# EAGLE design Main_board (EAGLE 8.0.1)
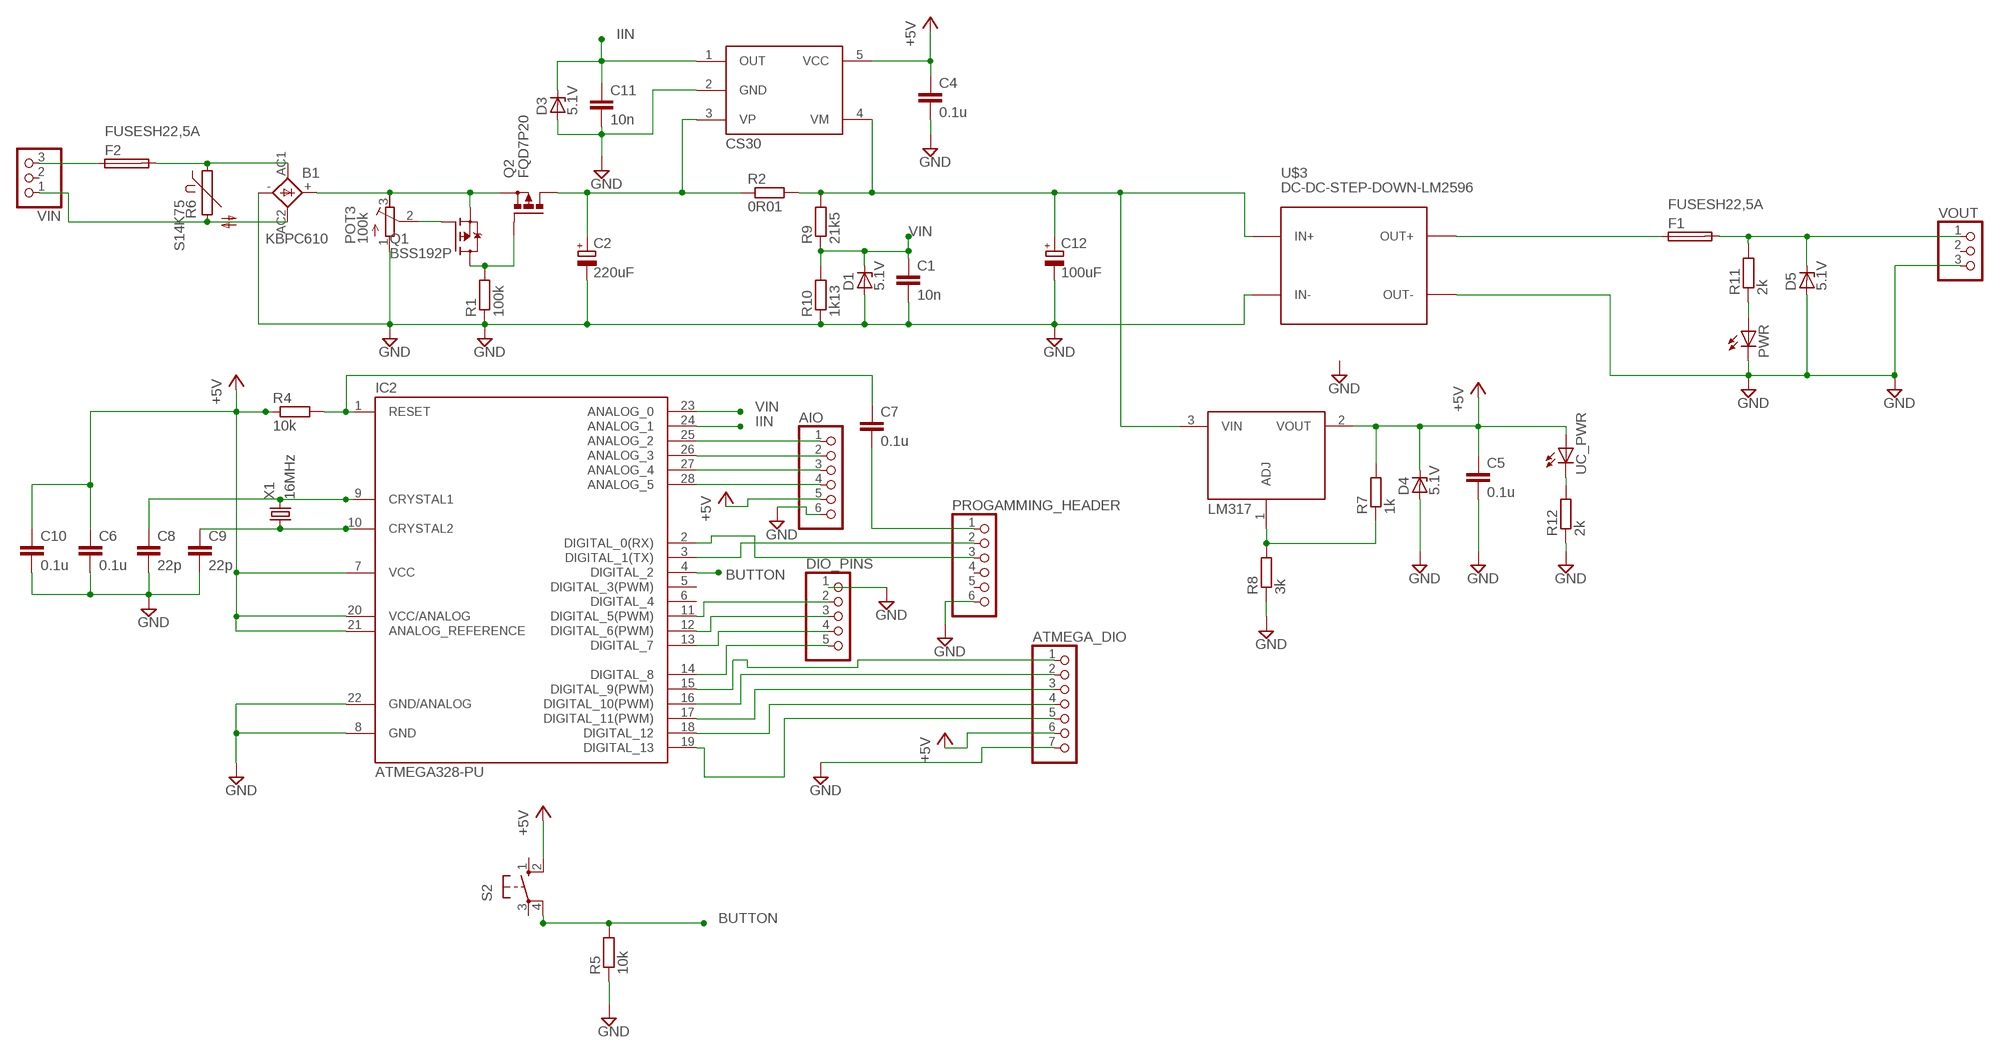
[diagram p0: schematic, sheet 1]

## Parts
AIO  PINHD-1X6  [1X06]
ATMEGA_DIO  PINHD-1X7  [1X07]
B1  KBPC610  GBPC6  [GBPC6]
C1  10n  C-EUC1206K  [C1206K]
C2  220uF  CPOL-EUE3.5-10  [E3,5-10]
C4  0.1u  C-EUC1206K  [C1206K]
C5  0.1u  C-EUC1206K  [C1206K]
C6  0.1u  C-EUC1206K  [C1206K]
C7  0.1u  C-EUC1206K  [C1206K]
C8  22p  C-EUC0805K  [C0805K]
C9  22p  C-EUC0805K  [C0805K]
C10  0.1u  C-EUC1206K  [C1206K]
C11  10n  C-EUC1206K  [C1206K]
C12  100uF  CPOL-EUE3.5-8  [E3,5-8]
D1  5.1V  ZPD  [DO35Z10]
D3  5.1V  ZPD  [DO35Z10]
D4  5.1V  ZPD  [DO35Z10]
D5  5.1V  ZPD  [DO35Z10]
DIO_PINS  PINHD-1X5  [1X05]
F1  FUSESH22,5A  [SH22,5A]
F2  FUSESH22,5A  [SH22,5A]
IC2  ATMEGA328-PU  ATMEGA168-PU  [DIL28-3]
POT3  100k  R-TRIMM3296W  [RTRIM3296W]
PROGAMMING_HEADER  PINHD-1X6  [1X06]
PWR  LEDSMT1206  [1206]
Q1  BSS192P  [BSS192P]
Q2  FQD7P20  [TO252]
R1  100k  R-EU_0207/10  [0207/10]
R2  0R01  R-EU_M1206  [M1206]
R4  10k  R-EU_R1206  [R1206]
R5  10k  R-EU_R1206  [R1206]
R6  S14K75  S14K17  [S14K17]
R7  1k  R-EU_R1206  [R1206]
R8  3k  R-EU_R1206  [R1206]
R9  21k5  R-EU_R0805  [R0805]
R10  1k13  R-EU_R0805  [R0805]
R11  2k  R-EU_R1206  [R1206]
R12  2k  R-EU_R1206  [R1206]
S2  10-XX  [B3F-10XX]
U$1  LM317  [TO220BH]
U$2  CS30  [SOT23-5L]
U$3  DC-DC-STEP-DOWN-LM2596  [DC-DC-STEP-DOWN-LM2596]
UC_PWR  LEDSMT1206  [1206]
VIN  PINHD-1X3  [1X03]
VOUT  PINHD-1X3  [1X03]
X1  16MHz  CRYSTALHC49S  [HC49/S]

## Nets
+5V: AIO.5 ATMEGA_DIO.6 C4.1 C5.1 C6.1 C10.1 D4.C IC2.7(VCC) IC2.20(VCC/ANALOG) IC2.21(ANALOG_REFERENCE) R4.1 R7.2 S2.2(S1) U$1.2(VOUT) U$2.5(VCC) UC_PWR.A
ANALOG_2: AIO.1 IC2.25(ANALOG_2)
ANALOG_3: AIO.2 IC2.26(ANALOG_3)
ANALOG_4: AIO.3 IC2.27(ANALOG_4)
ANALOG_5: AIO.4 IC2.28(ANALOG_5)
BUTTON: IC2.4(DIGITAL_2) R5.2 S2.4(P1)
CRYSTAL1: C8.1 IC2.9(CRYSTAL1) X1.2
CRYSTAL2: C9.1 IC2.10(CRYSTAL2) X1.1
D5: DIO_PINS.2 IC2.11(DIGITAL_5(PWM))
D6: DIO_PINS.3 IC2.12(DIGITAL_6(PWM))
D7: DIO_PINS.4 IC2.13(DIGITAL_7)
D8: DIO_PINS.5 IC2.14(DIGITAL_8)
D9: ATMEGA_DIO.1 IC2.15(DIGITAL_9(PWM))
D10: ATMEGA_DIO.2 IC2.16(DIGITAL_10(PWM))
D11: ATMEGA_DIO.3 IC2.17(DIGITAL_11(PWM))
D12: ATMEGA_DIO.4 IC2.18(DIGITAL_12)
D13: ATMEGA_DIO.5 IC2.19(DIGITAL_13)
GND: AIO.6 ATMEGA_DIO.7 B1.- C1.2 C2.- C4.2 C5.2 C6.2 C8.2 C9.2 C10.2 C11.2 C12.- D1.A D3.A D4.A D5.A DIO_PINS.1 IC2.8(GND) IC2.22(GND/ANALOG) POT3.1(A) PROGAMMING_HEADER.6 PWR.C R1.1 R5.1 R8.1 R10.1 R12.1 U$2.2(GND) U$3.IN- U$3.OUT- VOUT.3
IIN: C11.1 D3.C IC2.24(ANALOG_1) U$2.1(OUT)
N$1: F2.1 VIN.3
N$4: IC2.3(DIGITAL_1(TX)) PROGAMMING_HEADER.2
N$5: IC2.2(DIGITAL_0(RX)) PROGAMMING_HEADER.3
N$14: C7.2 PROGAMMING_HEADER.1
N$18: PWR.A R11.1
N$23: R7.1 R8.2 U$1.1(ADJ)
N$28: R12.2 UC_PWR.C
Q1_GATE: POT3.2(S) Q1.1(G)
Q2_GATE: Q1.2(D) Q1.4(D) Q2.1(G) R1.2
RESET: C7.1 IC2.1(RESET) R4.2
VIN: C1.1 D1.C IC2.23(ANALOG_0) R9.1 R10.2
VIN_AC1: B1.AC1 F2.2 R6.1
VIN_AC2: B1.AC2 R6.2 VIN.1
VIN_CURRENT_MEASURED: C12.+ R2.2 R9.2 U$1.3(VIN) U$2.4(VM) U$3.IN+
VIN_PROTECTED: C2.+ Q2.3(D) R2.1 U$2.3(VP)
VIN_UNPROTECTED: B1.+ POT3.3(E) Q1.3(S) Q2.2(S)
VOUT_FINAL: D5.C F1.2 R11.2 VOUT.1
VOUT_PREFUSE: F1.1 U$3.OUT+
Unconnected: IC2.5(DIGITAL_3(PWM)) IC2.6(DIGITAL_4) PROGAMMING_HEADER.4 PROGAMMING_HEADER.5 S2.1(S) S2.3(P) VIN.2 VOUT.2

## Library data of the parts
AIO PROGAMMING_HEADER = pinhead:PINHD-1X6: PIN HEADER
ATMEGA_DIO = pinhead:PINHD-1X7: PIN HEADER
B1 = rectifier:GBPC6: GENERAL INSTRUMENT RECTIFIER
C1 C4-C11 = resistor:C-EU: CAPACITOR, European symbol
C2 C12 = resistor:CPOL-EU: POLARIZED CAPACITOR, European symbol
D1 D3-D5 = diode:ZPD: Z DIODE 500 mW
DIO_PINS = pinhead:PINHD-1X5: PIN HEADER
F1 F2 = fuse:FUSE: Fuse; OC_FARNELL: unknown; OC_NEWARK: unknown
IC2 = Arduino-AVR:ATMEGA168-PU
POT3 = resistor:R-TRIMM: Trimm resistor
PWR UC_PWR = adafruit:LED: LED OSRAM: - CHIPLED LG R971, LG N971, LY N971, LG Q971, LY Q971, LO R971, LY R971 LH N974, LH R974 LS Q976, LO Q976, LY Q976 LO Q996 - Hyper CHIPLED LW Q18S LB Q993, LB Q99A, LB R99A - SideLED LS A670, LO A670, LY A670, LG A670, LP A670 LB A673, LV A673, LT A673, LW A673 LH A674 LY A675 LS A676, LA A676, LO A676, LY A676, LW A676 LS A679, LY A679, LG A679 - Hyper Micro SIDELED® LS Y876, LA Y876, LO Y876, LY Y876 LT Y87S - SmartLED LW L88C, LW L88S LB L89C, LB L89S, LG L890 LS L89K, LO L89K, LY L89K LS L896, LA L896, LO L896, LY L896 - TOPLED LS T670, LO T670, LY T670, LG T670, LP T670 LSG T670, LSP T670, LSY T670, LOP T670, LYG T670 LG T671, LOG T671, LSG T671 LB T673, LV T673, LT T673, LW T673 LH T674 LS T676, LA T676, LO T676, LY T676, LB T676, LH T676, LSB T676, LW T676 LB T67C, LV T67C, LT T67C, LS T67K, LO T67K, LY T67K, LW E67C LS E67B, LA E67B, LO E67B, LY E67B, LB E67C, LV E67C, LT E67C LW T67C LS T679, LY T679, LG T679 LS T770, LO T770, LY T770, LG T770, LP T770 LB T773, LV T773, LT T773, LW T773 LH T774 LS E675, LA E675, LY E675, LS T675 LS T776, LA T776, LO T776, LY T776, LB T776 LHGB T686 LT T68C, LB T68C - Hyper Mini TOPLED® LB M676 - Mini TOPLED Santana® LG M470 LS M47K, LO M47K, LY M47K Source: http://www.osram.convergy.de/
Q1 = Samson:BSS192P
Q2 = Samson:FQD7P20
R1 R2 R4 R5 R7-R12 = resistor:R-EU_: RESISTOR, European symbol
R6 = varistor:S14K17: VARISTOR
S2 = switch-omron:10-XX: OMRON SWITCH; MPN: B3F-1000; OC_FARNELL: 176432; OC_NEWARK: 36M3542
U$1 = Samson:LM317
U$2 = Samson:CS30
U$3 = diy-modules:DC-DC-STEP-DOWN-LM2596: DC/DC Step-Down Regulator based on LM2596-ADJ chip LM2596 datasheet available here: http://www.ti.com/lit/ds/symlink/lm2596.pdf Click here to find device on ebay.com <http://www.ebay.com/sch/lm2596+power+regulator>
VIN VOUT = pinhead:PINHD-1X3: PIN HEADER
X1 = crystal:CRYSTAL: CRYSTAL; OC_FARNELL: 1667008; OC_NEWARK: unknown

## Module BB1
Ports: 

### Library data of the parts

## Board
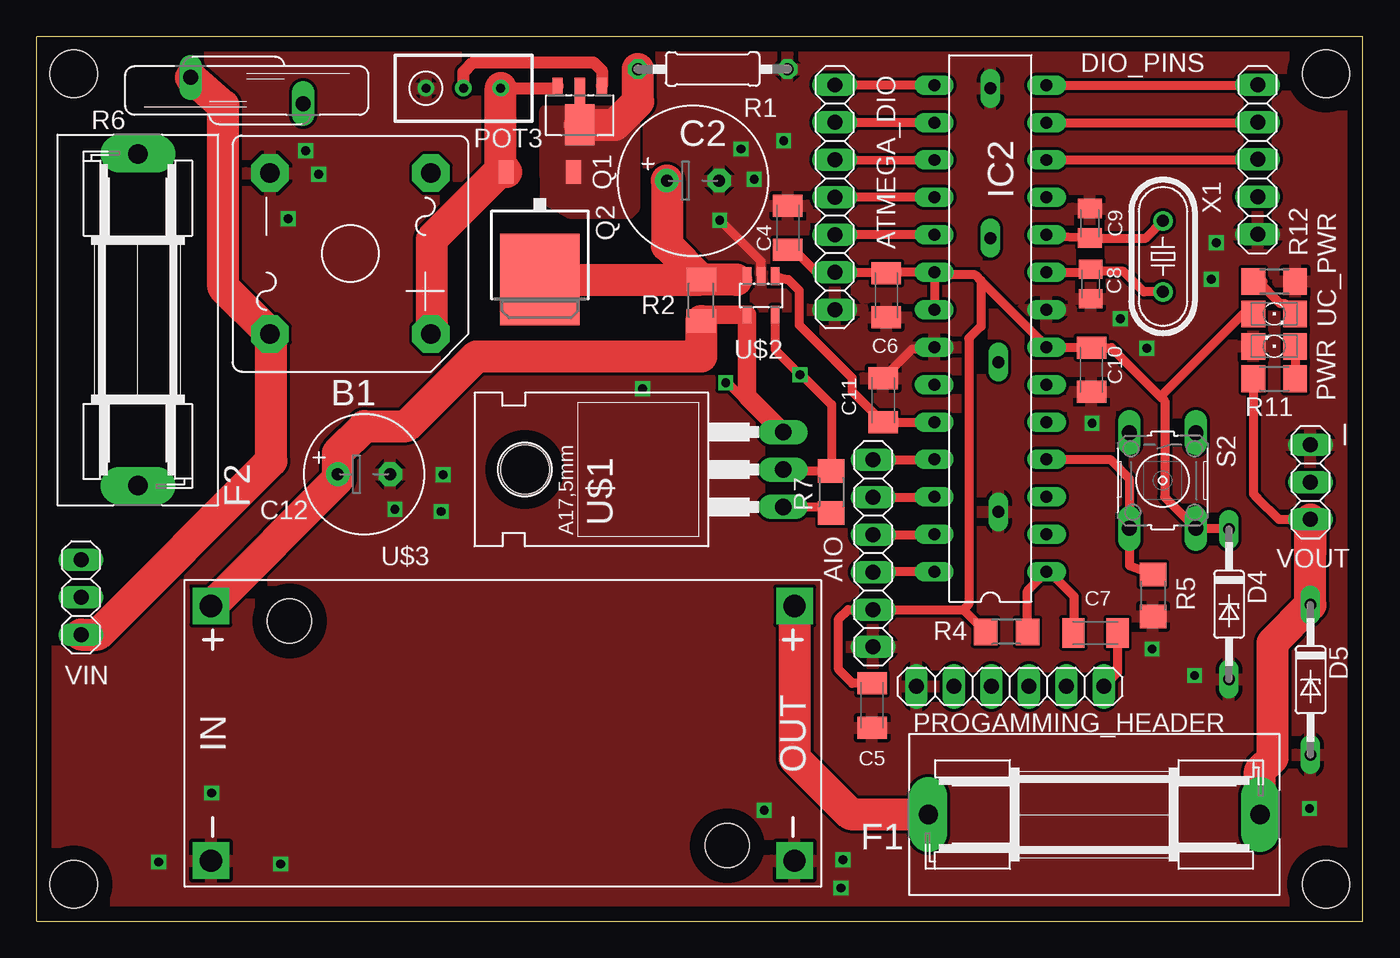
[diagram p1: board, top side]
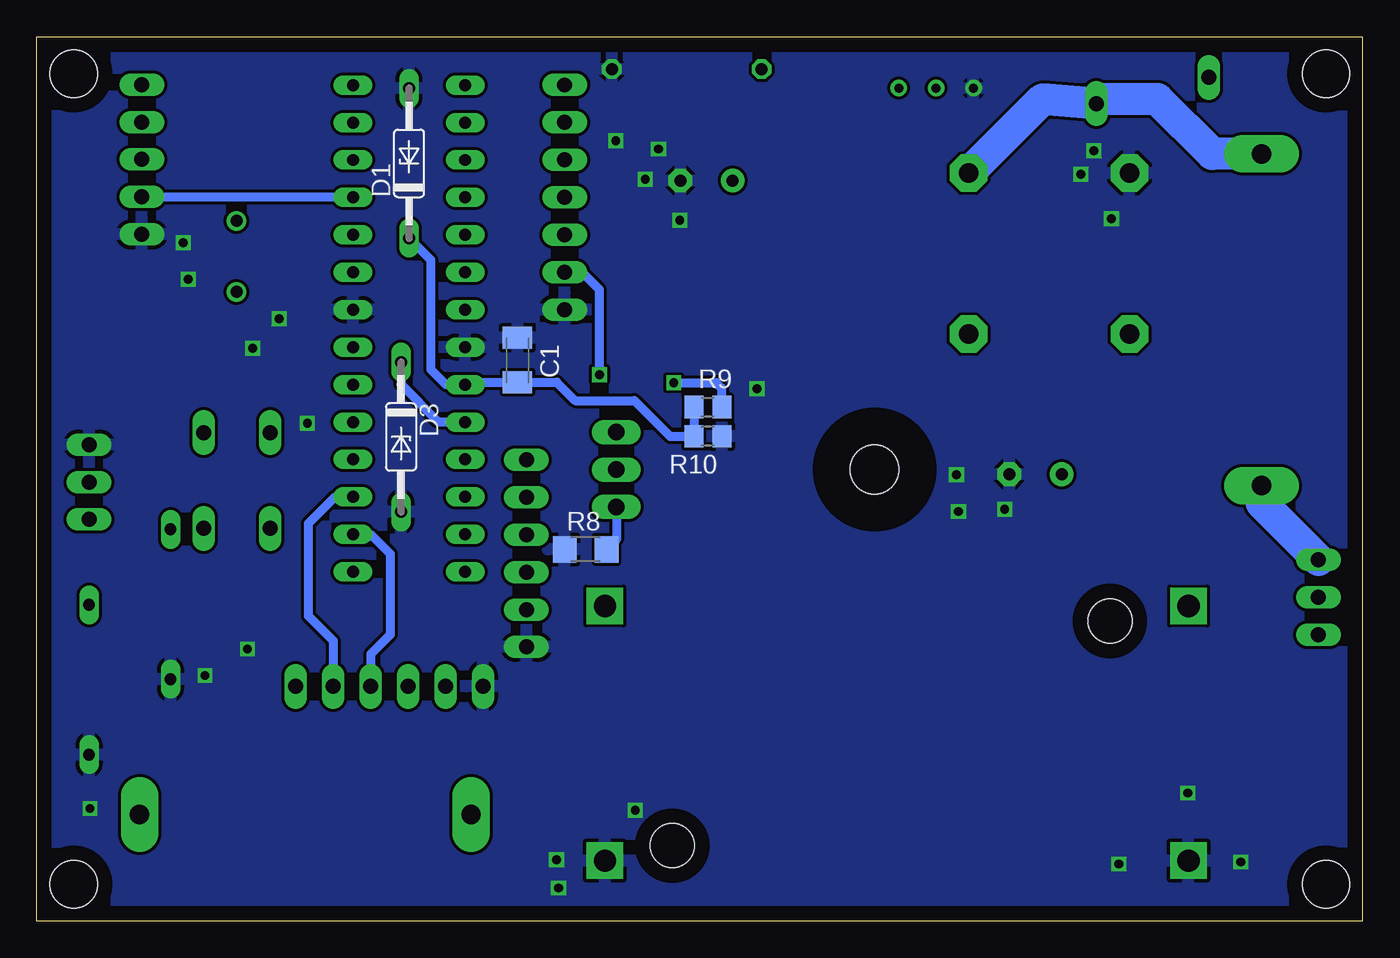
[diagram p2: board, bottom side, seen from below]

Size 90 x 60 mm. Coordinates in mm from the lower left corner, seen from the top.
Outline: 0,0 90,0 90,60 0,60 0,0
Copper layers (1*16): Top 0.035mm / dielectric 1.5mm / Bottom 0.035mm
Design rules "default *": minimum track width 10mil, minimum drill 20mil, track to track 8mil, track to pad 8mil, pad to pad 8mil, via to via 8mil, smd to smd 8mil, copper to edge 40mil, drill to drill 8mil, minimum pad ring 10mil, minimum via ring 8mil, stop-mask expansion 4mil, vias tented up to drill 0mil, thermal gap 10mil
Holes 3.2 mm at 2.5,57.5 87.5,57.5 87.5,2.5 2.5,2.5

### Footprints (pad centres in the part's own frame; a part is rotated, then mirrored left to right if it is on the bottom)
1X06 = drill 1.016 long: 1 -6.35,0; 2 -3.81,0; 3 -1.27,0; 4 1.27,0; 5 3.81,0; 6 6.35,0
1X07 = drill 1.016 long: 1 -7.62,0; 2 -5.08,0; 3 -2.54,0; 4 0,0; 5 2.54,0; 6 5.08,0; 7 7.62,0
GBPC6 = drill 1.321 pad 2.54 octagon: + 5.461,5.461; - -5.461,-5.461; AC1 -5.461,5.461; AC2 5.461,-5.461
C1206K = smd 1.5 x 2: 1 -1.5,0; 2 1.5,0
E3,5-10 = drill 0.813 pad 1.6: + -1.778,0 | drill 0.813 pad 1.6 octagon: - 1.778,0
C0805K = smd 1.3 x 1.6: 1 -1,0; 2 1,0
E3,5-8 = drill 0.813 pad 1.6: + -1.778,0 | drill 0.813 pad 1.6 octagon: - 1.778,0
DO35Z10 = drill 0.813 long: A 5.08,0; C -5.08,0
1X05 = drill 1.016 long: 1 -5.08,0; 2 -2.54,0; 3 0,0; 4 2.54,0; 5 5.08,0
SH22,5A = drill 1.321 pad 2.54 long: 1 -11.252,0; 2 11.252,0
DIL28-3 = drill 0.813 long: 1 -16.51,-3.81; 2 -13.97,-3.81; 3 -11.43,-3.81; 4 -8.89,-3.81; 5 -6.35,-3.81; 6 -3.81,-3.81; 7 -1.27,-3.81; 8 1.27,-3.81; 9 3.81,-3.81; 10 6.35,-3.81; 11 8.89,-3.81; 12 11.43,-3.81; 13 13.97,-3.81; 14 16.51,-3.81; 15 16.51,3.81; 16 13.97,3.81; 17 11.43,3.81; 18 8.89,3.81; 19 6.35,3.81; 20 3.81,3.81; 21 1.27,3.81; 22 -1.27,3.81; 23 -3.81,3.81; 24 -6.35,3.81; 25 -8.89,3.81; 26 -11.43,3.81; 27 -13.97,3.81; 28 -16.51,3.81
RTRIM3296W = drill 0.61: 1 0,-2.54; 2 0,0; 3 0,2.54
1206 = smd 1.6 x 1.803: A -1.422,0; C 1.422,0
BSS192P = smd 0.7 x 1.1: 1 -1.5,-1.75; 3 1.5,-1.75 | smd 0.7 x 1.8: 2 0,-1.4 | smd 2 x 2.8: 4 0,0.9
TO252 = smd 1 x 1.6: 1 -2.28,-4.8; 2 2.28,-4.8 | smd 5.4 x 6.2: 3 0,2.5
0207/10 = drill 0.813 octagon: 1 -5.08,0; 2 5.08,0
M1206 = smd 1.6 x 2: 1 -1.4,0; 2 1.4,0
R1206 = smd 1.6 x 1.803: 1 -1.422,0; 2 1.422,0
S14K17 = drill 1.016 long: 1 -0.889,-3.81; 2 0.889,3.81
R0805 = smd 1.3 x 1.5: 1 -0.95,0; 2 0.95,0
B3F-10XX = drill 1.016 long: 1 -3.251,2.261; 2 3.251,2.261; 3 -3.251,-2.261; 4 3.251,-2.261
TO220BH = drill 1.118 long: 1 -2.54,-6.35; 2 0,-6.35; 3 2.54,-6.35 | hole 3.302: 0,11.176
SOT23-5L = smd 0.55 x 1.2: 1 -0.95,-1.3; 2 0,-1.3; 3 0.95,-1.3; 4 0.95,1.3; 5 -0.95,1.3
DC-DC-STEP-DOWN-LM2596 = drill 1.5 pad 2.5 square: IN+ -19.812,8.636; IN- -19.812,-8.636; OUT+ 19.812,8.636; OUT- 19.812,-8.636 | hole 3: -14.478,7.62; 15.24,-7.62
1X03 = drill 1.016 long: 1 -2.54,0; 2 0,0; 3 2.54,0
HC49/S = drill 0.813: 1 -2.413,0; 2 2.413,0

### Placement (x,y rotation side)
AIO  56.77,24.95 270 top
ATMEGA_DIO  54.18,49.11 270 top
B1  21.29,45.29 270 top
C1  57.37,38.07 90 bottom
C2  44.54,50.25 0 top
C4  50.98,47.05 90 top
C5  56.7,14.63 270 top
C6  57.67,42.46 270 top
C7  71.86,19.55 0 top
C8  71.54,43.22 270 top
C9  71.48,47.35 90 top
C10  71.59,37.41 270 top
C11  57.45,35.34 90 top
C12  22.21,30.32 0 top
D1  64.73,51.42 90 bottom
D3  65.28,32.85 270 bottom
D4  80.93,21.5 270 top
D5  86.46,16.37 270 top
DIO_PINS  82.87,51.68 90 top
F1  71.77,7.23 0 top
F2  6.85,40.8 90 top
IC2  64.73,40.21 90 top
POT3  28.96,56.52 270 top
PROGAMMING_HEADER  66.07,15.92 180 top
PWR  84,39 180 top
Q1  36.85,54.93 180 top
Q2  34.15,46.03 180 top
R1  45.88,57.81 180 top
R2  45.09,42.13 270 top
R4  65.83,19.62 0 top
R5  75.77,22.1 90 top
R6  14.26,56.36 90 top
R7  53.93,29.11 90 top
R8  52.75,25.22 0 bottom
R9  44.45,34.88 0 bottom
R10  44.45,32.9 180 bottom
R11  84,36.8 180 top
R12  84,43.4 180 top
S2  76.43,29.89 270 top
U$1  44.31,30.64 90 top
U$2  49.17,42.45 180 top
U$3  31.63,12.74 0 top
UC_PWR  84,41.2 0 top
VIN  3,21.97 90 top
VOUT  86.45,29.79 90 top
X1  76.45,45.1 270 top

### Tracks (layer width: path | path; a pad name or v marks a point on that pad's centre or on a via)
+5V  (via drill 0.6)
  Top 0.61: 64.09,43.46 63.7,43.85 61.09,43.85 IC2.20 | 64.09,43.46 68.54,39.01 IC2.7 71.56,38.94 C10.1 72.95,38.91 76.28,35.58 | IC2.20 IC2.21 | IC2.20 57.67,44.02 C6.1 57.67,44.01 54.85,44.03 | 54.85,44.03 ATMEGA_DIO.6 | 57.36,21.14 62.9,21.13 | 57.36,21.14 AIO.5 | 62.9,21.13 R4.1 | 76.28,35.58 76.56,35.3 76.56,28.77 S2.2 80.87,26.64 D4.C | UC_PWR.A 81.9,41.2 76.28,35.58 | 64.09,43.46 64.09,40.36 63.27,39.54 63.27,21.5 62.9,21.13 | C4.1 51.41,45.55 52.96,44 54.82,44 54.85,44.03 | C5.1 55.36,16.13 54.42,17.07 54.42,20.5 55.06,21.14 57.36,21.14 | U$2.5 50.12,38.77 v51.81,37.08 | v51.81,37.08 51.81,36.99 | v51.81,37.08 51.92,37.08 53.95,35.05 53.95,30.55 R7.2 50.77,30.53 U$1.2
  Bottom 0.61: v51.81,37.08 51.81,42.85 52.96,44 54.14,44 ATMEGA_DIO.6
ANALOG_2
  Top 0.61: AIO.1 60.9,31.3 IC2.25
ANALOG_3
  Top 0.61: AIO.2 60.9,28.76 IC2.26
ANALOG_4
  Top 0.61: AIO.3 60.9,26.22 IC2.27
ANALOG_5
  Top 0.61: IC2.28 56.79,23.7 AIO.4
BUCK_OUTPUT
  pour Top (no thermals): 33.68,22.05 33.66,22.17 33.65,22.16
BUTTON
  Top 0.61: IC2.4 72.86,31.32 74.15,30.03 74.15,26.66 S2.4 74.17,24.13 R5.2
CRYSTAL1
  Top 0.61: IC2.9 71.34,44.02 C8.1 71.68,44.08 73.76,44.08 75.15,42.69 X1.2
CRYSTAL2
  Top 0.61: IC2.10 68.64,46.47 C9.1 75.28,46.35 X1.1
D5
  Bottom 0.61: IC2.11 82.83,49.1 DIO_PINS.2
D6
  Top 0.61: IC2.12 82.83,51.64 DIO_PINS.3
D7
  Top 0.61: IC2.13 82.83,54.18 DIO_PINS.4
D8
  Top 0.61: IC2.14 82.83,56.72 DIO_PINS.5
D9
  Top 0.61: IC2.15 54.24,56.72 ATMEGA_DIO.1
D10
  Top 0.61: 54.38,54.18 ATMEGA_DIO.2 54.24,54.18 IC2.16
D11
  Top 0.61: 54.38,51.64 ATMEGA_DIO.3 IC2.17
D12
  Top 0.61: 54.38,49.1 ATMEGA_DIO.4 54.24,49.1 IC2.18
D13
  Top 0.61: 54.38,46.56 ATMEGA_DIO.5 54.24,46.56 IC2.19
GND  (via drill 0.6)
  Top 0.61: U$2.2 49.17,44.76 v46.36,47.57 | C11.2 59.44,38.83 60.81,38.83 IC2.22
  other vias: 86.39,7.64 17.07,47.66 24.3,27.94 75.36,38.86 79.72,43.54 19.12,50.69 73.56,40.86 80.06,46.02 78.59,16.66 71.64,33.77 75.71,18.47 50.7,52.96 48.7,50.35 47.79,52.39 41.11,36.11 18.25,52.28 8.27,4.01 16.55,3.88 27.57,30.3 27.45,27.8 54.58,2.25 54.71,4.17 49.38,7.53 11.88,8.69
  pour Bottom (rank 2): 0.03,58.94 -0.33,-2.4 91.15,-0.88 91.71,60.48
  pour Top (rank 5): -0.33,59.42 -0.92,-1.45 91.58,-0.87 91.89,60.3
IIN
  Top 0.61: 60.88,33.82 IC2.24 60.9,33.84 C11.1 55.34,35.95 55.34,36.85 51.74,40.45 51.74,42.8 51.02,43.52 U$2.1
  Bottom 0.61: D3.C 65.28,36.41 62.76,33.89 60.95,33.89 IC2.24
N$1
  Bottom 2.184: F2.1 6.85,28.36 VIN.3
N$4
  Bottom 0.61: IC2.3 69.75,28.78 71.57,26.96 71.57,20.7 69.88,19.01 PROGAMMING_HEADER.2
N$5
  Bottom 0.61: IC2.2 67.34,26.24 66.01,24.91 66.01,19.44 67.33,18.12 PROGAMMING_HEADER.3
N$14
  Top 0.61: C7.2 73.36,16.87 PROGAMMING_HEADER.1
N$18
  Top 0.61: PWR.A R11.1
N$23
  Top 0.61: U$1.1 53.52,28.1 R7.1
  Bottom 0.61: U$1.1 50.66,25.89 R8.2
N$28
  Top 0.61: 83.22,43.4 R12.2 82.9,43.4 84.39,41.91 84.71,41.91 UC_PWR.C
Q1_GATE
  Top 0.813: POT3.2 28.95,57.6 29.62,58.27 37.79,58.27 38.36,57.7 Q1.1
Q2_GATE
  Top 0.61: Q1.2 36.85,54.72 36.91,54.66 36.91,54.09 Q1.4
  Top 2.184: Q1.4 39.24,54.03 40.81,55.6 R1.2
  pour Top (no thermals): 39.77,54.96 40.53,54.31 40.53,48.36 40.2,48.03 36.23,48.03 34.55,48.97 34.51,54.96
RESET
  Top 0.61: C7.1 70.41,19.6 70.41,22.03 68.74,23.7 IC2.1 67.25,22.41 R4.2
VIN
  Bottom 0.61: D1.C 63.24,44.85 63.24,37.42 62.22,36.4 IC2.23 60.76,36.57 C1.1 54.71,36.57 53.46,35.32 49.44,35.32 47.01,32.89 R10.2 R9.1
VIN_AC1
  Bottom 2.184: F2.2 10.21,52.05 13.93,55.77 18.06,55.77 R6.1 21.74,55.76 B1.AC1
VIN_AC2
  Top 2.184: R6.2 12.66,55.33 12.66,43.02 15.83,39.85 B1.AC2 15.91,39.74 15.91,31.22 4.12,19.43 VIN.1
VIN_CURRENT_MEASURED  (via drill 0.6)
  Top 0.61: 48.22,35.62 47.8,35.62 47.1,36.32 46.97,36.32 v46.76,36.53
  Top 1.27: R2.2 45.09,41.15 U$2.4 48.22,35.62 U$1.3
  Top 2.184: R2.2 45.1,38.32 29.84,38.32 25.1,33.58 22.25,33.58 20.43,31.76 C12.+ 20.43,29.99 U$3.IN+
  Bottom 0.61: v46.76,36.53 43.89,36.53 43.52,36.16 43.52,34.9 R9.2
VIN_PROTECTED
  Top 0.61: U$2.3 47.49,43.75 47.49,43.53
  Top 2.184: Q2.3 R2.1 | C2.+ 42.76,45.86 R2.1 | R2.1 47.49,43.53 47.49,43.5
  pour Top (no thermals): 44.16,44.26 44.12,42.74 44,42.86 44,44.14 44.12,44.26
VIN_UNPROTECTED
  Top 0.813: POT3.3 35.19,56.52 Q1.3
  Top 2.184: POT3.3 31.5,51.2 Q2.2 31.37,50.83 26.8,46.26 26.8,39.87 B1.+
VOUT_FINAL
  Top 0.61: 82.86,28.7 82.58,28.98 | 82.86,28.7 84.31,27.25 VOUT.1 | R11.2 82.58,28.98 | 82.58,28.98 82.86,28.7
  Top 2.184: 86.45,25.05 VOUT.1 D5.C 83.89,18.88 83.89,11.05 83.03,10.19 F1.2
VOUT_PREFUSE
  Top 2.184: U$3.OUT+ 51.44,11.04 55.23,7.25 60.5,7.25 F1.1

### Text on the board
tNames: _ | +